# Altium project Dynamics_Module.PrjPcb
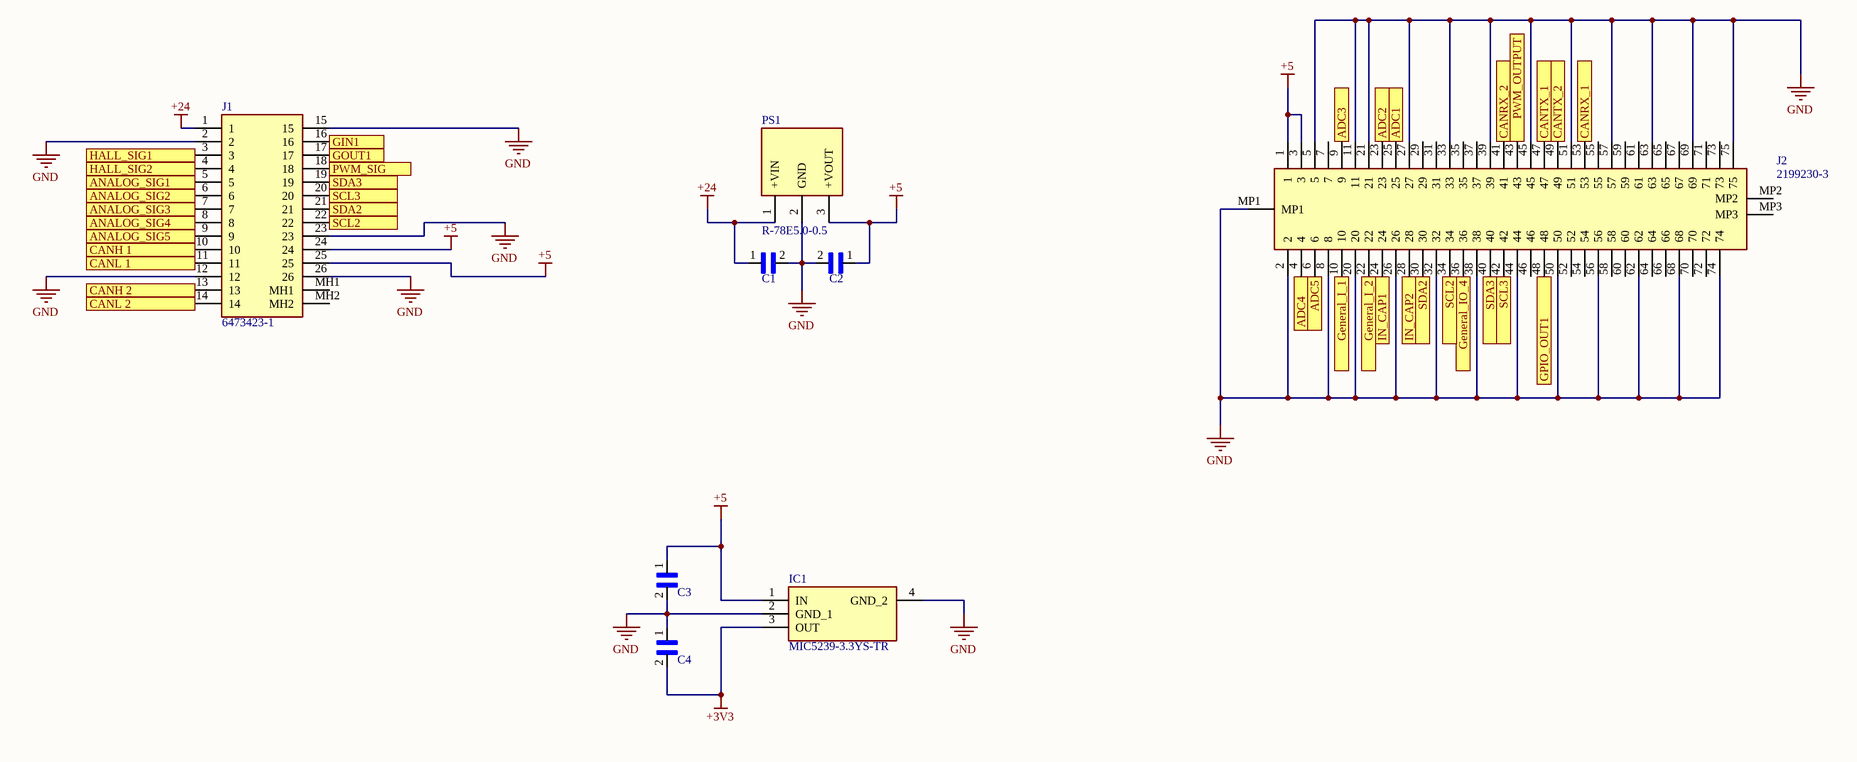
[diagram p0: Dynamics_Sch.SchDoc]
4 sheets, 61 parts. Net scope: flat (ports and power ports of the same name join across sheets).
Board file: Dynamics v1.0.0.PcbDoc
Sheets:
  Dynamics_Sch.SchDoc
  Communication.SchDoc
  Analog_Circuit.SchDoc
  Analog_Circuit_1.SchDoc

## Sheet Dynamics_Sch.SchDoc
size A3; SheetNumber: 1; SheetTotal: 4

### Parts
C1  0805_Capacitor  [0805_Capacitor]  (value not drawn)
C2  0805_Capacitor  [0805_Capacitor]  (value not drawn)
C3  0805_Capacitor  [0805_Capacitor]  (value not drawn)
C4  0805_Capacitor  [0805_Capacitor]  (value not drawn)
IC1  MIC5239-3.3YS-TR  [SOT230P700X180-4N]
J1  6473423-1  [CONN26_6473423-1_TEC]
J2  2199230-3  [21992303]
PS1  R-78E5.0-0.5  [R78E5005]

### Ports
ADC1 (see Analog_Circuit[2A]), ADC2 (see Analog_Circuit[1C]), ADC3 (see Analog_Circuit[1D]), ADC4 (see Analog_Circuit[3A]), ADC5 (see Analog_Circuit[3B]), ANALOG_SIG1 (see Analog_Circuit[1A]), ANALOG_SIG2 (see Analog_Circuit[1C]), ANALOG_SIG3 (see Analog_Circuit[1D]), ANALOG_SIG4 (see Analog_Circuit[2A]), ANALOG_SIG5 (see Analog_Circuit[2B]), CANH 1 (see Communication[2A]), CANH 2 (see Communication[2B]), CANL 1 (see Communication[2A]), CANL 2 (see Communication[2B]), CANRX_1 (see Communication[2A]), CANRX_2 (see Communication[2B]), CANTX_1 (see Communication[2A]), CANTX_2 (see Communication[2B]), General_I_1 (see Analog_Circuit_1[1A]), General_I_2, General_IO_4, GIN1 (see Analog_Circuit_1[1A]), GOUT1 (see Analog_Circuit_1[2C]), GPIO_OUT1 (see Analog_Circuit_1[1C]), HALL_SIG1 (see Analog_Circuit[3B]), HALL_SIG2 (see Analog_Circuit[3C]), IN_CAP1 (see Analog_Circuit[4A]), IN_CAP2 (see Analog_Circuit[4C]), PWM_OUTPUT (see Analog_Circuit[2D]), PWM_SIG (see Analog_Circuit[3C]), SCL2 (see Dynamics_Sch[2B]), SCL2 (see Dynamics_Sch[7B]), SCL3 (see Dynamics_Sch[2B]), SCL3 (see Dynamics_Sch[7B]), SDA2 (see Dynamics_Sch[2B]), SDA2 (see Dynamics_Sch[6B]), SDA3 (see Dynamics_Sch[2B]), SDA3 (see Dynamics_Sch[7B])

### Nets
+3V3: C4.2 IC1.3(OUT)
+5: C2.1 C3.1 IC1.1(IN) J1.24 J1.25 J2.1 J2.3 PS1.3(+VOUT)
+24: C1.1 J1.1 PS1.1(+VIN)
GND: C1.2 C2.2 C3.2 C4.1 IC1.2(GND_1) IC1.4(GND_2) J1.2 J1.12 J1.15 J1.23 J1.26 J2.2 J2.5 J2.8 J2.11 J2.20 J2.21 J2.26 J2.27 J2.32 J2.33 J2.38 J2.39 J2.44 J2.45 J2.50 J2.51 J2.56 J2.57 J2.62 J2.63 J2.68 J2.69 J2.74 J2.75 J2.MP1 PS1.2(GND)
NetC9_1: J2.25 ; port ADC1
NetC10_1: J2.4 ; port ADC4
NetC11_1: J2.23 ; port ADC2
NetC12_1: J2.6 ; port ADC5
NetC13_1: J2.9 ; port ADC3
NetC14_1: J2.10 ; port General_I_1
NetIC2_1: J2.47 ; port CANTX_1
NetIC2_4: J2.53 ; port CANRX_1
NetIC2_6: J1.11 ; port CANL 1
NetIC2_7: J1.10 ; port CANH 1
NetIC3_1: J2.49 ; port CANTX_2
NetIC3_4: J2.41 ; port CANRX_2
NetIC3_6: J1.14 ; port CANL 2
NetIC3_7: J1.13 ; port CANH 2
NetJ1_3: J1.3 ; port HALL_SIG1
NetJ1_4: J1.4 ; port HALL_SIG2
NetJ1_5: J1.5 ; port ANALOG_SIG1
NetJ1_6: J1.6 ; port ANALOG_SIG2
NetJ1_7: J1.7 ; port ANALOG_SIG3
NetJ1_8: J1.8 ; port ANALOG_SIG4
NetJ1_9: J1.9 ; port ANALOG_SIG5
NetJ1_16: J1.16 ; port GIN1
NetJ1_17: J1.17 ; port GOUT1
NetJ1_18: J1.18 ; port PWM_SIG
NetJ1_19: J1.19 J2.40 ; port SDA3
NetJ1_20: J1.20 J2.42 ; port SCL3
NetJ1_21: J1.21 J2.30 ; port SDA2
NetJ1_22: J1.22 J2.34 ; port SCL2
NetJ2_22: J2.22 ; port General_I_2
NetJ2_24: J2.24 ; port IN_CAP1
NetJ2_28: J2.28 ; port IN_CAP2
NetJ2_36: J2.36 ; port General_IO_4
NetJ2_43: J2.43 ; port PWM_OUTPUT
NetJ2_48: J2.48 ; port GPIO_OUT1

Not connected (* = marked no-connect by the designer): J1 MH1 MH2; J2 7 29 31 35 37 46 52 54 55 58 59 60 61 64 65 66 67 70 71 72 73 MP2 MP3

### Library data of the parts
C1-C4 = 0805_Capacitor: MP: CL21B104KBCNNNC; MF: Samsung; Availability: Unavailable; Package: 0805 Samsung; Value: *; Price: None; SnapEDA_Link: https://www.snapeda.com/parts/CL21B104KBCNNNC/Samsung/view-part/3597943/?ref=snap
IC1 = MIC5239-3.3YS-TR: Integrated Circuit; Manufacturer_Name: Microchip; Datasheet Link: https://ww1.microchip.com/downloads/en/DeviceDoc/mic5239.pdf; Height: 1.8mm; Manufacturer_Part_Number: MIC5239-3.3YS-TR; Mouser Part Number: 998-MIC5239-3.3YSTR; Mouser Price/Stock: https://www.mouser.co.uk/ProductDetail/Microchip-Technology-Micrel/MIC5239-33YS-TR?qs=U6T8BxXiZAXN0UitWWB92A%3D%3D; Arrow Part Number: MIC5239-3.3YS-TR; Arrow Price/Stock: https://www.arrow.com/en/products/mic5239-3.3ys-tr/microchip-technology?region=nac
J1 = 6473423-1: Connector; Manufacturer_Name: TE Connectivity; Datasheet Link: https://www.te.com/commerce/DocumentDelivery/DDEController?Action=showdoc&DocId=Customer+Drawing%7F9-1437287-8%7FA1%7Fpdf%7FEnglish%7FENG_CD_9-1437287-8_A1.pdf%7F6473423-1; Height: 27.9mm; Manufacturer_Part_Number: 6473423-1; Mouser Part Number: 571-6473423-1; Mouser Price/Stock: https://www.mouser.co.uk/ProductDetail/TE-Connectivity/6473423-1?qs=XhI5AayaxxW9FyxB9N39mQ%3D%3D
J2 = 2199230-3: Connector; Manufacturer_Name: TE Connectivity; Datasheet Link: https://componentsearchengine.com/Datasheets/2/2199230-3.pdf; Height: 4.2mm; Manufacturer_Part_Number: 2199230-3; Mouser Part Number: 571-2199230-3; Mouser Price/Stock: https://www.mouser.co.uk/ProductDetail/TE-Connectivity/2199230-3?qs=EQCnRgr4b6HElQOKr5ma1Q%3D%3D; Arrow Part Number: 2199230-3; Arrow Price/Stock: https://www.arrow.com/en/products/2199230-3/te-connectivity?region=nac
PS1 = R-78E5.0-0.5: Power Supply; Manufacturer_Name: RECOM Power; Datasheet Link: https://datasheet.datasheetarchive.com/originals/distributors/Datasheets_SAMA/1560217c2d38d5ce10907af13420fc49.pdf; Height: 10.9mm; Manufacturer_Part_Number: R-78E5.0-0.5; Mouser Part Number: 919-R-78E5.0-0.5; Mouser Price/Stock: https://www.mouser.co.uk/ProductDetail/RECOM-Power/R-78E5.0-0.5?qs=JeAkOuORR2UvBuiB2kZVZQ%3D%3D; Arrow Part Number: R-78E5.0-0.5; Arrow Price/Stock: https://www.arrow.com/en/products/r-78e5.0-0.5/recom-power?region=europe

## Sheet Communication.SchDoc
size A4; SheetNumber: 2; SheetTotal: 4
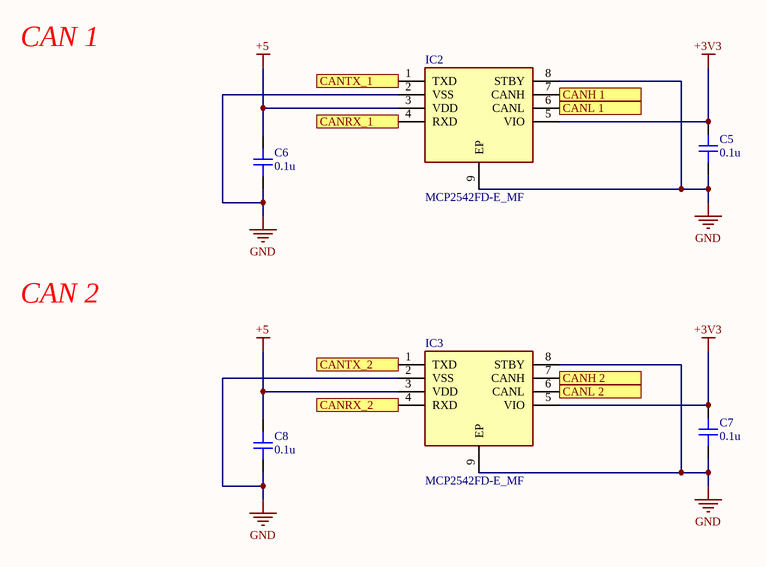
[diagram p1: Communication.SchDoc]

### Parts
C5  0.1u  [CAP_0805]
C6  0.1u  [CAP_0805]
C7  0.1u  [CAP_0805]
C8  0.1u  [CAP_0805]
IC2  MCP2542FD-E_MF  [SON65P300X300X100-9N-D]
IC3  MCP2542FD-E_MF  [SON65P300X300X100-9N-D]

### Ports
CANH 1 (see Dynamics_Sch[1B]), CANH 2 (see Dynamics_Sch[1B]), CANL 1 (see Dynamics_Sch[1B]), CANL 2 (see Dynamics_Sch[1C]), CANRX_1 (see Dynamics_Sch[6B]), CANRX_2 (see Dynamics_Sch[6B]), CANTX_1 (see Dynamics_Sch[6B]), CANTX_2 (see Dynamics_Sch[6B])

### Nets
+3V3: C5.2 C7.2 IC2.5(VIO) IC3.5(VIO)
+5: C6.2 C8.2 IC2.3(VDD) IC3.3(VDD)
GND: C5.1 C6.1 C7.1 C8.1 IC2.2(VSS) IC2.8(STBY) IC2.9(EP) IC3.2(VSS) IC3.8(STBY) IC3.9(EP)
NetIC2_1: IC2.1(TXD) ; port CANTX_1
NetIC2_4: IC2.4(RXD) ; port CANRX_1
NetIC2_6: IC2.6(CANL) ; port CANL 1
NetIC2_7: IC2.7(CANH) ; port CANH 1
NetIC3_1: IC3.1(TXD) ; port CANTX_2
NetIC3_4: IC3.4(RXD) ; port CANRX_2
NetIC3_6: IC3.6(CANL) ; port CANL 2
NetIC3_7: IC3.7(CANH) ; port CANH 2

### Notes on the sheet
- CAN 1
- CAN 2

### Library data of the parts
C5-C8 = CAP_0805_10V: Capacitor SMD 0805 10V
IC2 IC3 = MCP2542FD-E_MF: Integrated Circuit; Manufacturer_Name: Microchip; Manufacturer_Part_Number: MCP2542FD-E/MF; Datasheet Link: http://ww1.microchip.com/downloads/en/devicedoc/20005514a.pdf; Height: 1mm; Mouser Part Number: 579-MCP2542FD-E/MF; Mouser Price/Stock: https://www.mouser.co.uk/ProductDetail/Microchip-Technology-Atmel/MCP2542FD-E-MF?qs=l7cgNqFNU1jog4BwTzULBw%3D%3D; Arrow Part Number: MCP2542FD-E/MF; Arrow Price/Stock: https://www.arrow.com/en/products/mcp2542fd-emf/microchip-technology?region=nac

## Sheet Analog_Circuit.SchDoc
size A4; SheetNumber: 3; SheetTotal: 4
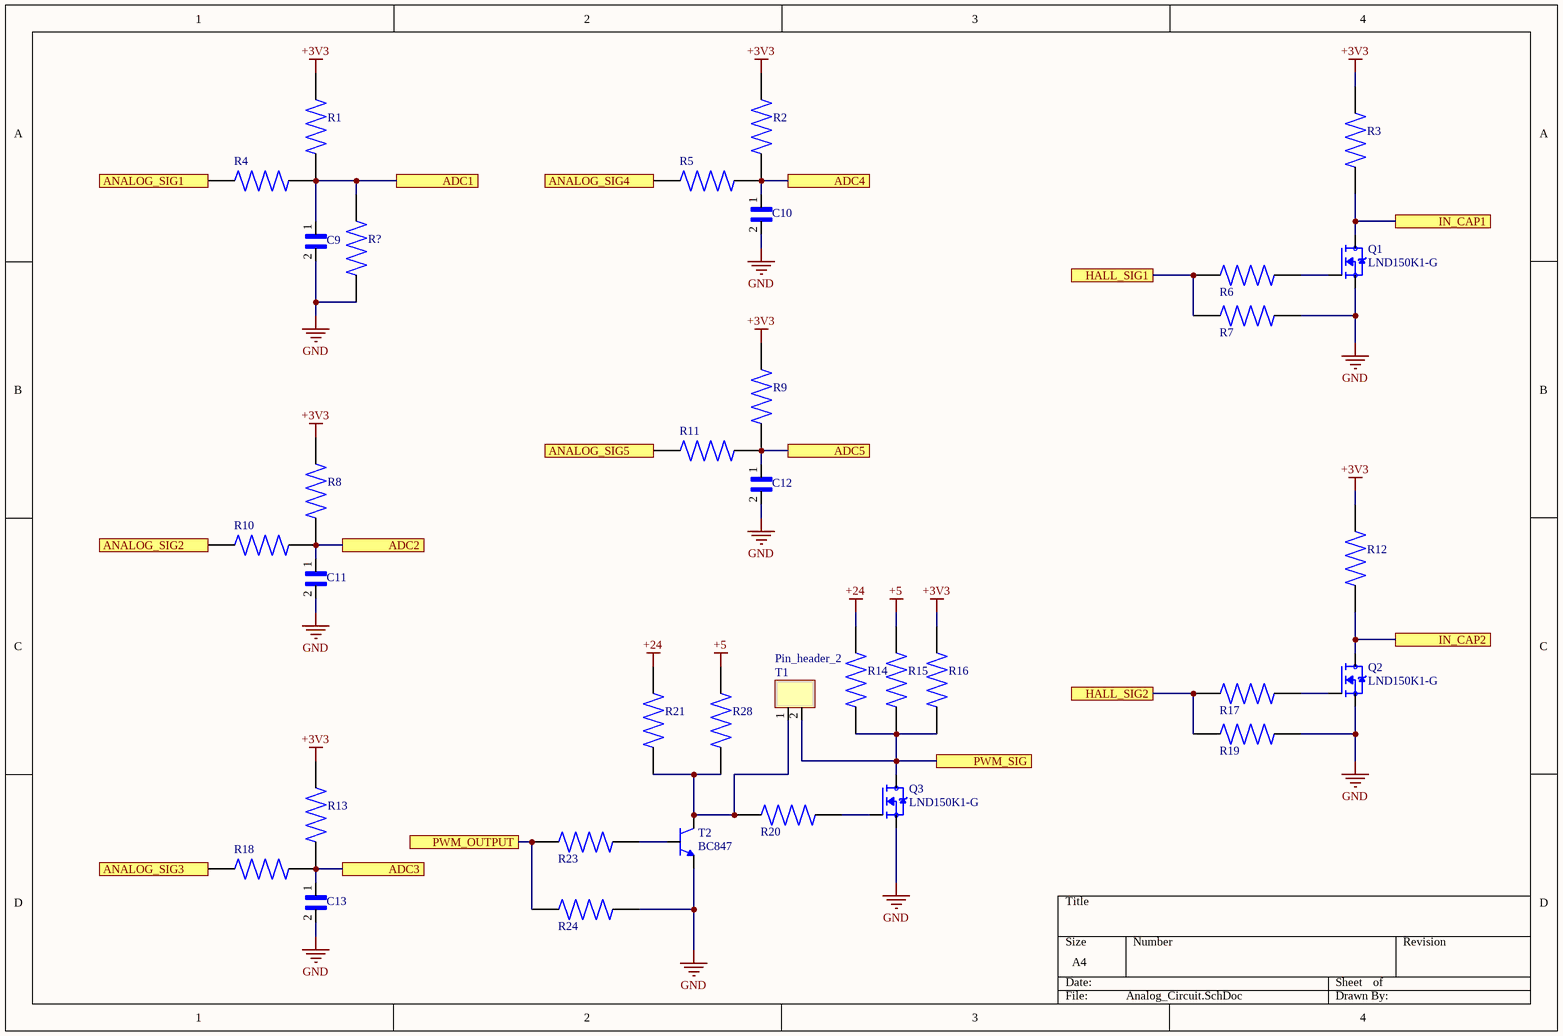
[diagram p2: Analog_Circuit.SchDoc]

### Parts
(Parts that share a designator on the sheet are numbered #1, #2 ... from top to bottom, then left to right.)
C9  0805_Capacitor  [0805_Capacitor]  (value not drawn)
C10  0805_Capacitor  [0805_Capacitor]  (value not drawn)
C11  0805_Capacitor  [0805_Capacitor]  (value not drawn)
C12  0805_Capacitor  [0805_Capacitor]  (value not drawn)
C13  0805_Capacitor  [0805_Capacitor]  (value not drawn)
Q1  LND150K1-G  [SOT93-NMOS]
Q2  LND150K1-G  [SOT93-NMOS]
Q3  LND150K1-G  [SOT93-NMOS]
R1  0805_Resistor  [0805_Resistor]  (value not drawn)
R2  0805_Resistor  [0805_Resistor]  (value not drawn)
R3  0805_Resistor  [0805_Resistor]  (value not drawn)
R4  0805_Resistor  [0805_Resistor]  (value not drawn)
R5  0805_Resistor  [0805_Resistor]  (value not drawn)
R6  0805_Resistor  [0805_Resistor]  (value not drawn)
R7  0805_Resistor  [0805_Resistor]  (value not drawn)
R8  0805_Resistor  [0805_Resistor]  (value not drawn)
R9  0805_Resistor  [0805_Resistor]  (value not drawn)
R10  0805_Resistor  [0805_Resistor]  (value not drawn)
R11  0805_Resistor  [0805_Resistor]  (value not drawn)
R12  0805_Resistor  [0805_Resistor]  (value not drawn)
R13  0805_Resistor  [0805_Resistor]  (value not drawn)
R14  0805_Resistor  [0805_Resistor]  (value not drawn)
R15  0805_Resistor  [0805_Resistor]  (value not drawn)
R16  0805_Resistor  [0805_Resistor]  (value not drawn)
R17  0805_Resistor  [0805_Resistor]  (value not drawn)
R18  0805_Resistor  [0805_Resistor]  (value not drawn)
R19  0805_Resistor  [0805_Resistor]  (value not drawn)
R20  0805_Resistor  [0805_Resistor]  (value not drawn)
R21  0805_Resistor  [0805_Resistor]  (value not drawn)
R23#1  0805_Resistor  [0805_Resistor]  (value not drawn)
R24#1  0805_Resistor  [0805_Resistor]  (value not drawn)
R28  0805_Resistor  [0805_Resistor]  (value not drawn)
R?  0805_Resistor  [0805_Resistor]  (value not drawn)
T1  Pin_header_2  [Pin_header_2]
T2  BC847  [SOT23]

### Ports
ADC1 (see Dynamics_Sch[6B]), ADC2 (see Dynamics_Sch[6B]), ADC3 (see Dynamics_Sch[6B]), ADC4 (see Dynamics_Sch[6B]), ADC5 (see Dynamics_Sch[6B]), ANALOG_SIG1 (see Dynamics_Sch[1B]), ANALOG_SIG2 (see Dynamics_Sch[1B]), ANALOG_SIG3 (see Dynamics_Sch[1B]), ANALOG_SIG4 (see Dynamics_Sch[1B]), ANALOG_SIG5 (see Dynamics_Sch[1B]), HALL_SIG1 (see Dynamics_Sch[1B]), HALL_SIG2 (see Dynamics_Sch[1B]), IN_CAP1 (see Dynamics_Sch[6B]), IN_CAP2 (see Dynamics_Sch[6B]), PWM_OUTPUT (see Dynamics_Sch[7B]), PWM_SIG (see Dynamics_Sch[2B])

### Nets
+3V3: R1.2 R2.2 R3.1 R8.2 R9.2 R12.1 R13.2 R16.1
+5: R15.1 R28.1
+24: R14.1 R21.2
GND: C9.2 C10.2 C11.2 C12.2 C13.2 Q1.3(S) Q2.3(S) Q3.3(S) R7.2 R19.2 R24#1.1 R?.1 T2.2(E)
NetC9_1: C9.1 R1.1 R4.2 R?.2 ; port ADC1
NetC10_1: C10.1 R2.1 R5.2 ; port ADC4
NetC11_1: C11.1 R8.1 R10.2 ; port ADC2
NetC12_1: C12.1 R9.1 R11.2 ; port ADC5
NetC13_1: C13.1 R13.1 R18.2 ; port ADC3
NetJ1_3: R6.2 R7.1 ; port HALL_SIG1
NetJ1_4: R17.2 R19.1 ; port HALL_SIG2
NetJ1_5: R4.1 ; port ANALOG_SIG1
NetJ1_6: R10.1 ; port ANALOG_SIG2
NetJ1_7: R18.1 ; port ANALOG_SIG3
NetJ1_8: R5.1 ; port ANALOG_SIG4
NetJ1_9: R11.1 ; port ANALOG_SIG5
NetJ1_18: Q3.2(D) R14.2 R15.2 R16.2 T1.2 ; port PWM_SIG
NetJ2_24: Q1.2(D) R3.2 ; port IN_CAP1
NetJ2_28: Q2.2(D) R12.2 ; port IN_CAP2
NetJ2_43: R23#1.2 R24#1.2 ; port PWM_OUTPUT
NetQ1_1: Q1.1(G) R6.1
NetQ2_1: Q2.1(G) R17.1
NetQ3_1: Q3.1(G) R20.1
NetR20_2: R20.2 R21.1 R28.2 T1.1 T2.3(C)
NetR23#1_1: R23#1.1 T2.1(B)

### Library data of the parts
C9-C13 = 0805_Capacitor: MP: CL21B104KBCNNNC; MF: Samsung; Availability: Unavailable; Package: 0805 Samsung; Value: *; Price: None; SnapEDA_Link: https://www.snapeda.com/parts/CL21B104KBCNNNC/Samsung/view-part/3597943/?ref=snap
Q1-Q3 = LND150K1-G: MOSFET, DEPLETION-MODE, 500V, 1K Ohm3 SOT-23 T/R | Microchip Technology Inc. LND150K1-G; SnapEDA_Link: https://www.snapeda.com/parts/LND150K1-G/Microchip/view-part/?ref=snap; Package: SOT-23 Microchip; Value: *; MF: Microchip; MP: LND150K1-G; Check_prices: https://www.snapeda.com/parts/LND150K1-G/Microchip/view-part/?ref=eda
R1-R21 R23#1 R24#1 R28 R? = 0805_Resistor: MF: Yageo; MP: RC0805FR-07910RL; Package: 2012 Rohm Semiconductor; Value: *; Purchase-URL: https://pricing.snapeda.com/search/part/RC0805FR-07910RL/?ref=eda; Availability: In Stock; Price: None
T2 = BC847: <b>NPN TRANSISTOR</b>; Availability: Unavailable; Package: None; MP: BC847; Value: *; Price: None

## Sheet Analog_Circuit_1.SchDoc
size A4; SheetNumber: 4; SheetTotal: 4
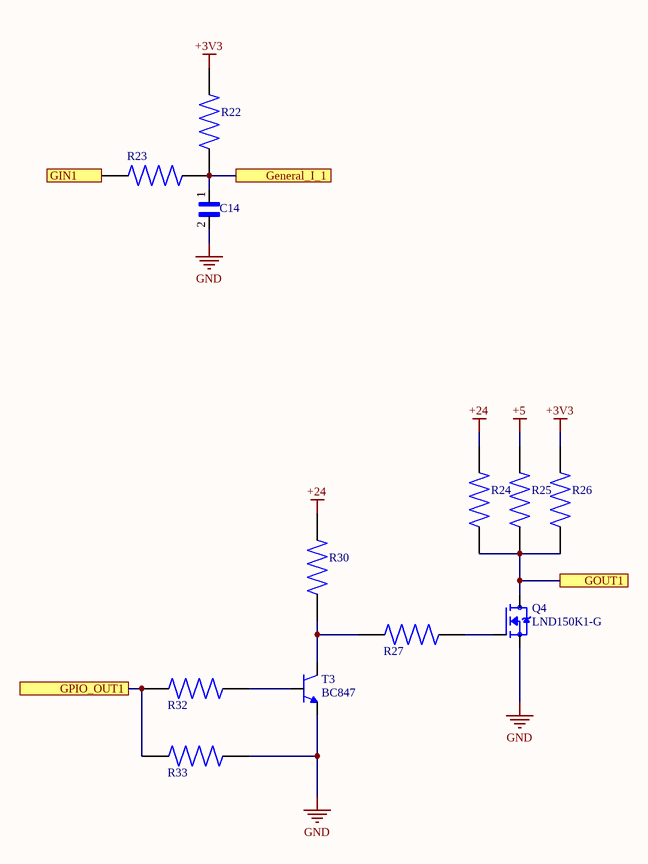
[diagram p3: Analog_Circuit_1.SchDoc]

### Parts
(Parts that share a designator on the sheet are numbered #1, #2 ... from top to bottom, then left to right.)
C14  0805_Capacitor  [0805_Capacitor]  (value not drawn)
Q4  LND150K1-G  [SOT93-NMOS]
R22  0805_Resistor  [0805_Resistor]  (value not drawn)
R23#2  0805_Resistor  [0805_Resistor]  (value not drawn)
R24#2  0805_Resistor  [0805_Resistor]  (value not drawn)
R25  0805_Resistor  [0805_Resistor]  (value not drawn)
R26  0805_Resistor  [0805_Resistor]  (value not drawn)
R27  0805_Resistor  [0805_Resistor]  (value not drawn)
R30  0805_Resistor  [0805_Resistor]  (value not drawn)
R32  0805_Resistor  [0805_Resistor]  (value not drawn)
R33  0805_Resistor  [0805_Resistor]  (value not drawn)
T3  BC847  [SOT23]

### Ports
General_I_1 (see Dynamics_Sch[6C]), GIN1 (see Dynamics_Sch[2B]), GOUT1 (see Dynamics_Sch[2B]), GPIO_OUT1 (see Dynamics_Sch[6C])

### Nets
+3V3: R22.2 R26.1
+5: R25.1
+24: R24#2.1 R30.2
GND: C14.2 Q4.3(S) R33.1 T3.2(E)
NetC14_1: C14.1 R22.1 R23#2.2 ; port General_I_1
NetJ1_16: R23#2.1 ; port GIN1
NetJ1_17: Q4.2(D) R24#2.2 R25.2 R26.2 ; port GOUT1
NetJ2_48: R32.2 R33.2 ; port GPIO_OUT1
NetQ4_1: Q4.1(G) R27.1
NetR27_2: R27.2 R30.1 T3.3(C)
NetR32_1: R32.1 T3.1(B)

### Library data of the parts
C14 = 0805_Capacitor: MP: CL21B104KBCNNNC; MF: Samsung; Availability: Unavailable; Package: 0805 Samsung; Value: *; Price: None; SnapEDA_Link: https://www.snapeda.com/parts/CL21B104KBCNNNC/Samsung/view-part/3597943/?ref=snap
Q4 = LND150K1-G: as Q1 on sheet Analog_Circuit; SnapEDA_Link: https://www.snapeda.com/parts/LND150K1-G/Microchip/view-part/?ref=snap; Package: SOT-23 Microchip; Value: *; MF: Microchip; MP: LND150K1-G; Check_prices: https://www.snapeda.com/parts/LND150K1-G/Microchip/view-part/?ref=eda
R22 R23#2 R24#2 R25-R27 R30 R32 R33 = 0805_Resistor: MF: Yageo; MP: RC0805FR-07910RL; Package: 2012 Rohm Semiconductor; Value: *; Purchase-URL: https://pricing.snapeda.com/search/part/RC0805FR-07910RL/?ref=eda; Availability: In Stock; Price: None
T3 = BC847: <b>NPN TRANSISTOR</b>; Availability: Unavailable; Package: None; MP: BC847; Value: *; Price: None

## Nets that join several sheets
+3V3: Dynamics_Sch (C4.2 IC1.3), Communication (C5.2 C7.2 IC2.5 IC3.5), Analog_Circuit (8 pins), Analog_Circuit_1 (R22.2 R26.1)
+5: Dynamics_Sch (8 pins), Communication (C6.2 C8.2 IC2.3 IC3.3), Analog_Circuit (R15.1 R28.1), Analog_Circuit_1 (R25.1)
+24: Dynamics_Sch (C1.1 J1.1 PS1.1), Analog_Circuit (R14.1 R21.2), Analog_Circuit_1 (R24#2.1 R30.2)
GND: Dynamics_Sch (37 pins), Communication (10 pins), Analog_Circuit (13 pins), Analog_Circuit_1 (C14.2 Q4.3 R33.1 T3.2)
NetC9_1: Dynamics_Sch (J2.25), Analog_Circuit (C9.1 R1.1 R4.2 R?.2)
NetC10_1: Dynamics_Sch (J2.4), Analog_Circuit (C10.1 R2.1 R5.2)
NetC11_1: Dynamics_Sch (J2.23), Analog_Circuit (C11.1 R8.1 R10.2)
NetC12_1: Dynamics_Sch (J2.6), Analog_Circuit (C12.1 R9.1 R11.2)
NetC13_1: Dynamics_Sch (J2.9), Analog_Circuit (C13.1 R13.1 R18.2)
NetC14_1: Dynamics_Sch (J2.10), Analog_Circuit_1 (C14.1 R22.1 R23#2.2)
NetIC2_1: Dynamics_Sch (J2.47), Communication (IC2.1)
NetIC2_4: Dynamics_Sch (J2.53), Communication (IC2.4)
NetIC2_6: Dynamics_Sch (J1.11), Communication (IC2.6)
NetIC2_7: Dynamics_Sch (J1.10), Communication (IC2.7)
NetIC3_1: Dynamics_Sch (J2.49), Communication (IC3.1)
NetIC3_4: Dynamics_Sch (J2.41), Communication (IC3.4)
NetIC3_6: Dynamics_Sch (J1.14), Communication (IC3.6)
NetIC3_7: Dynamics_Sch (J1.13), Communication (IC3.7)
NetJ1_3: Dynamics_Sch (J1.3), Analog_Circuit (R6.2 R7.1)
NetJ1_4: Dynamics_Sch (J1.4), Analog_Circuit (R17.2 R19.1)
NetJ1_5: Dynamics_Sch (J1.5), Analog_Circuit (R4.1)
NetJ1_6: Dynamics_Sch (J1.6), Analog_Circuit (R10.1)
NetJ1_7: Dynamics_Sch (J1.7), Analog_Circuit (R18.1)
NetJ1_8: Dynamics_Sch (J1.8), Analog_Circuit (R5.1)
NetJ1_9: Dynamics_Sch (J1.9), Analog_Circuit (R11.1)
NetJ1_16: Dynamics_Sch (J1.16), Analog_Circuit_1 (R23#2.1)
NetJ1_17: Dynamics_Sch (J1.17), Analog_Circuit_1 (Q4.2 R24#2.2 R25.2 R26.2)
NetJ1_18: Dynamics_Sch (J1.18), Analog_Circuit (5 pins)
NetJ2_24: Dynamics_Sch (J2.24), Analog_Circuit (Q1.2 R3.2)
NetJ2_28: Dynamics_Sch (J2.28), Analog_Circuit (Q2.2 R12.2)
NetJ2_43: Dynamics_Sch (J2.43), Analog_Circuit (R23#1.2 R24#1.2)
NetJ2_48: Dynamics_Sch (J2.48), Analog_Circuit_1 (R32.2 R33.2)